# EAGLE design untitled4 (EAGLE 7.2.0)
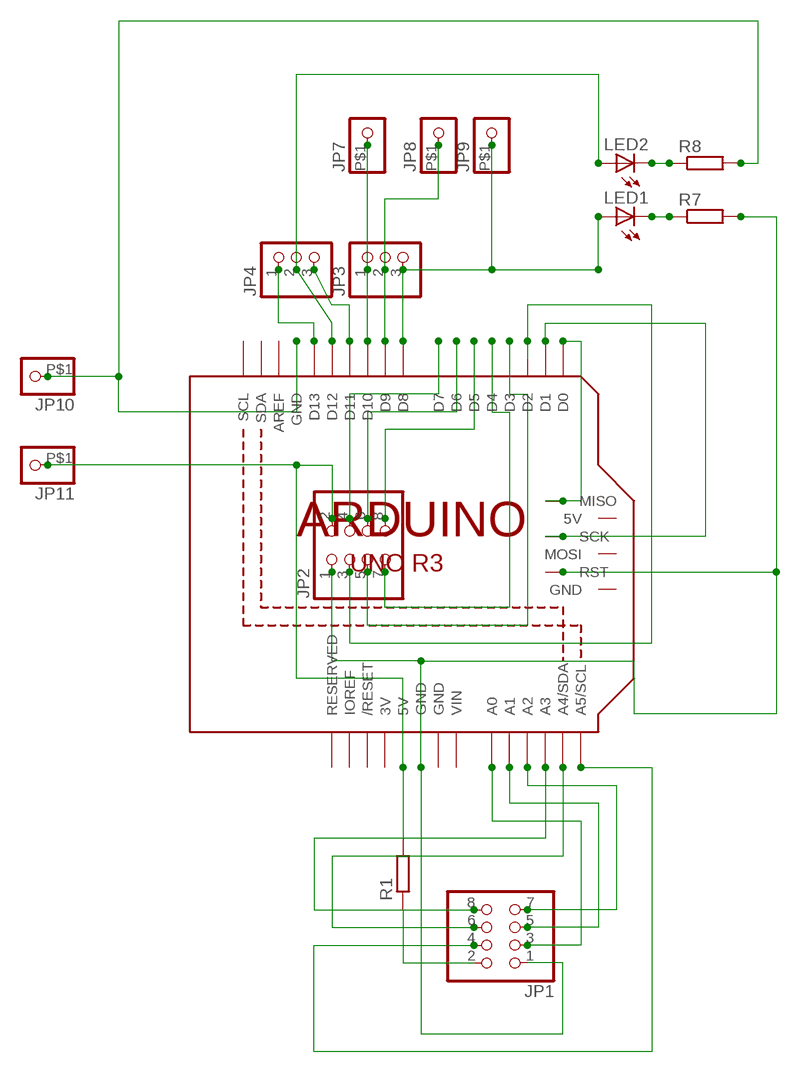
[diagram p0: schematic, sheet 1]

## Parts
JP1  PINHD-2X4  [2X04]
JP2  PINHD-2X4  [2X04]
JP3  PINHD-1X3  [1X03]
JP4  PINHD-1X3  [1X03]
JP7  PINHD-1X1-BIGPOGO  [1X1-BIGPOGO]
JP8  PINHD-1X1-BIGPOGO  [1X1-BIGPOGO]
JP9  PINHD-1X1-BIGPOGO  [1X1-BIGPOGO]
JP10  PINHD-1X1-BIGPOGO  [1X1-BIGPOGO]
JP11  PINHD-1X1-BIGPOGO  [1X1-BIGPOGO]
LED1  LED3MM  [LED3MM]
LED2  LED3MM  [LED3MM]
M1  ARDUINO_R3_ICSP_NODIM  [ARDUINOR3_ICSP_NODIM]
R1  R-EU_0207/10  [0207/10]
R7  R-EU_0207/10  [0207/10]
R8  R-EU_0207/10  [0207/10]

## Nets
N$2: JP2.2 JP11.P$1 M1.5V R1.2
N$3: M1.D0 M1.MISO
N$4: M1.D1 M1.SCK
N$6: JP1.2 R1.1
N$7: JP1.3 M1.A0
N$8: JP1.5 M1.A1
N$9: JP1.7 M1.A2
N$10: JP2.5 M1.D3
N$11: JP2.3 M1.D2
N$12: JP2.6 M1.D6
N$13: JP2.4 M1.D7
N$14: JP2.8 M1.D5
N$15: JP2.7 M1.D4
N$16: JP1.8 M1.A3
N$17: JP1.6 M1.A4(A4/SDA)
N$20: LED1.K(C) R7.1
N$21: JP4.3 M1.D11
N$23: JP10.P$1 M1.GND R8.2
N$26: JP1.4 M1.A5(A5/SCL)
N$29: LED2.K(C) R8.1
N$31: JP4.2 LED2.A M1.D12
N$32: JP4.1 M1.D13
N$33: JP3.2 JP8.P$1 M1.D9
N$34: JP3.1 JP7.P$1 M1.D10
N$35: JP3.3 JP9.P$1 LED1.A M1.D8
N$36: JP1.1 JP2.1 M1.GND@1(GND) R7.2
Unconnected: M1.5V_ICSP(5V) M1.AREF M1.GND@2(GND) M1.IOREF M1.MOSI M1.RESERVED M1.RESET(/RESET) M1.RESET_ICSP(RST) M1.SCL M1.SDA

## Power pins joined to a net without a drawn wire
3V: M1.3V
GND: M1.GND@3(GND)
VIN: M1.VIN

## Library data of the parts
JP1 JP2 = adafruit:PINHD-2X4: PIN HEADER
JP3 JP4 = adafruit:PINHD-1X3: PIN HEADER
JP7-JP11 = adafruit:PINHD-1X1: Pin header 1x1 for 0.1" spacing With round pins
LED1 LED2 = adafruit:LED: LED OSRAM: - CHIPLED LG R971, LG N971, LY N971, LG Q971, LY Q971, LO R971, LY R971 LH N974, LH R974 LS Q976, LO Q976, LY Q976 LO Q996 - Hyper CHIPLED LW Q18S LB Q993, LB Q99A, LB R99A - SideLED LS A670, LO A670, LY A670, LG A670, LP A670 LB A673, LV A673, LT A673, LW A673 LH A674 LY A675 LS A676, LA A676, LO A676, LY A676, LW A676 LS A679, LY A679, LG A679 - Hyper Micro SIDELED® LS Y876, LA Y876, LO Y876, LY Y876 LT Y87S - SmartLED LW L88C, LW L88S LB L89C, LB L89S, LG L890 LS L89K, LO L89K, LY L89K LS L896, LA L896, LO L896, LY L896 - TOPLED LS T670, LO T670, LY T670, LG T670, LP T670 LSG T670, LSP T670, LSY T670, LOP T670, LYG T670 LG T671, LOG T671, LSG T671 LB T673, LV T673, LT T673, LW T673 LH T674 LS T676, LA T676, LO T676, LY T676, LB T676, LH T676, LSB T676, LW T676 LB T67C, LV T67C, LT T67C, LS T67K, LO T67K, LY T67K, LW E67C LS E67B, LA E67B, LO E67B, LY E67B, LB E67C, LV E67C, LT E67C LW T67C LS T679, LY T679, LG T679 LS T770, LO T770, LY T770, LG T770, LP T770 LB T773, LV T773, LT T773, LW T773 LH T774 LS E675, LA E675, LY E675, LS T675 LS T776, LA T776, LO T776, LY T776, LB T776 LHGB T686 LT T68C, LB T68C - Hyper Mini TOPLED® LB M676 - Mini TOPLED Santana® LG M470 LS M47K, LO M47K, LY M47K Source: http://www.osram.convergy.de/
M1 = adafruit:ARDUINO_R3_ICSP
R1 R7 R8 = rcl:R-EU_: RESISTOR, European symbol

## Board
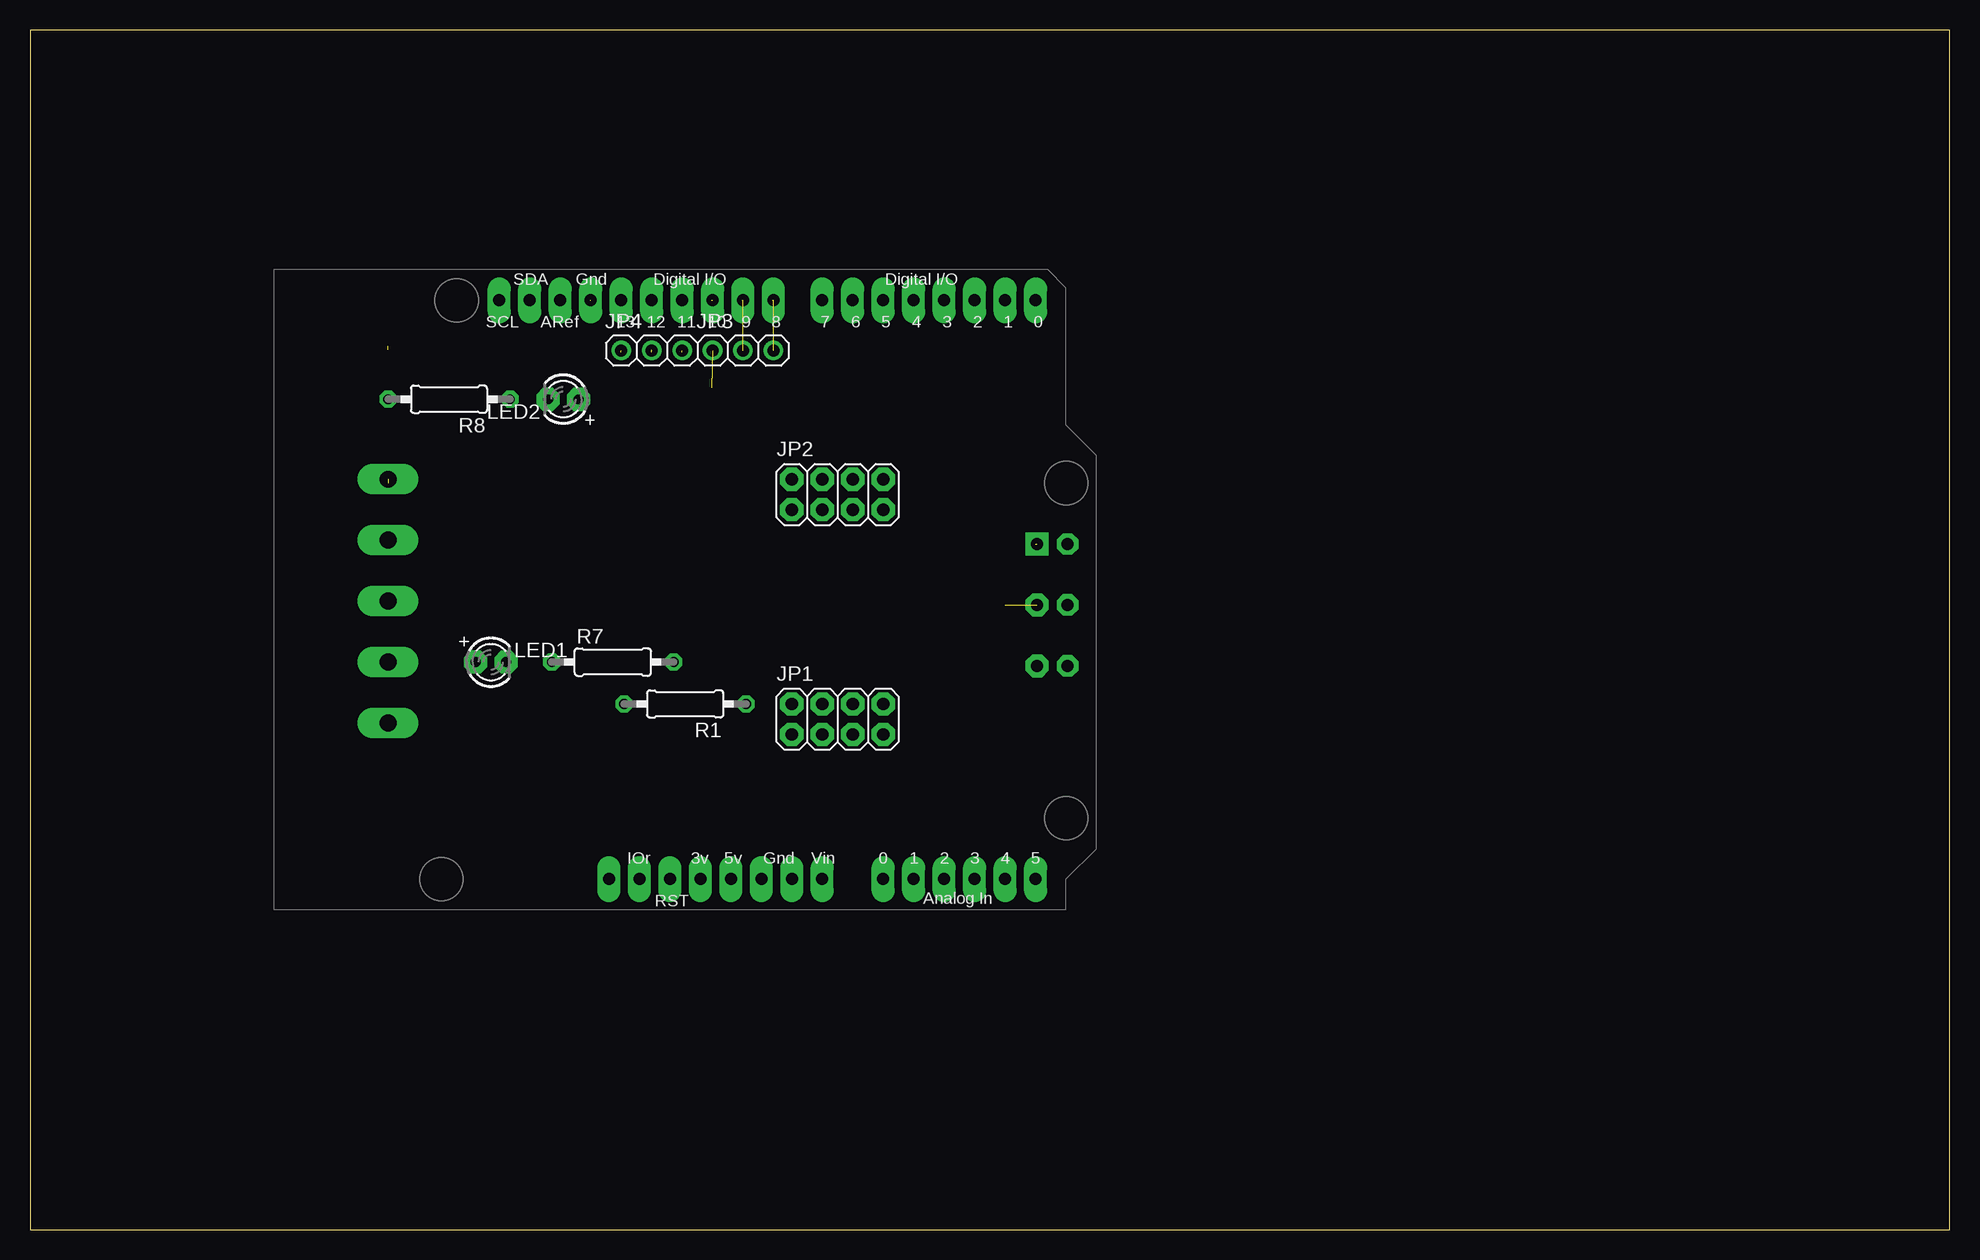
[diagram p1: board, top side]
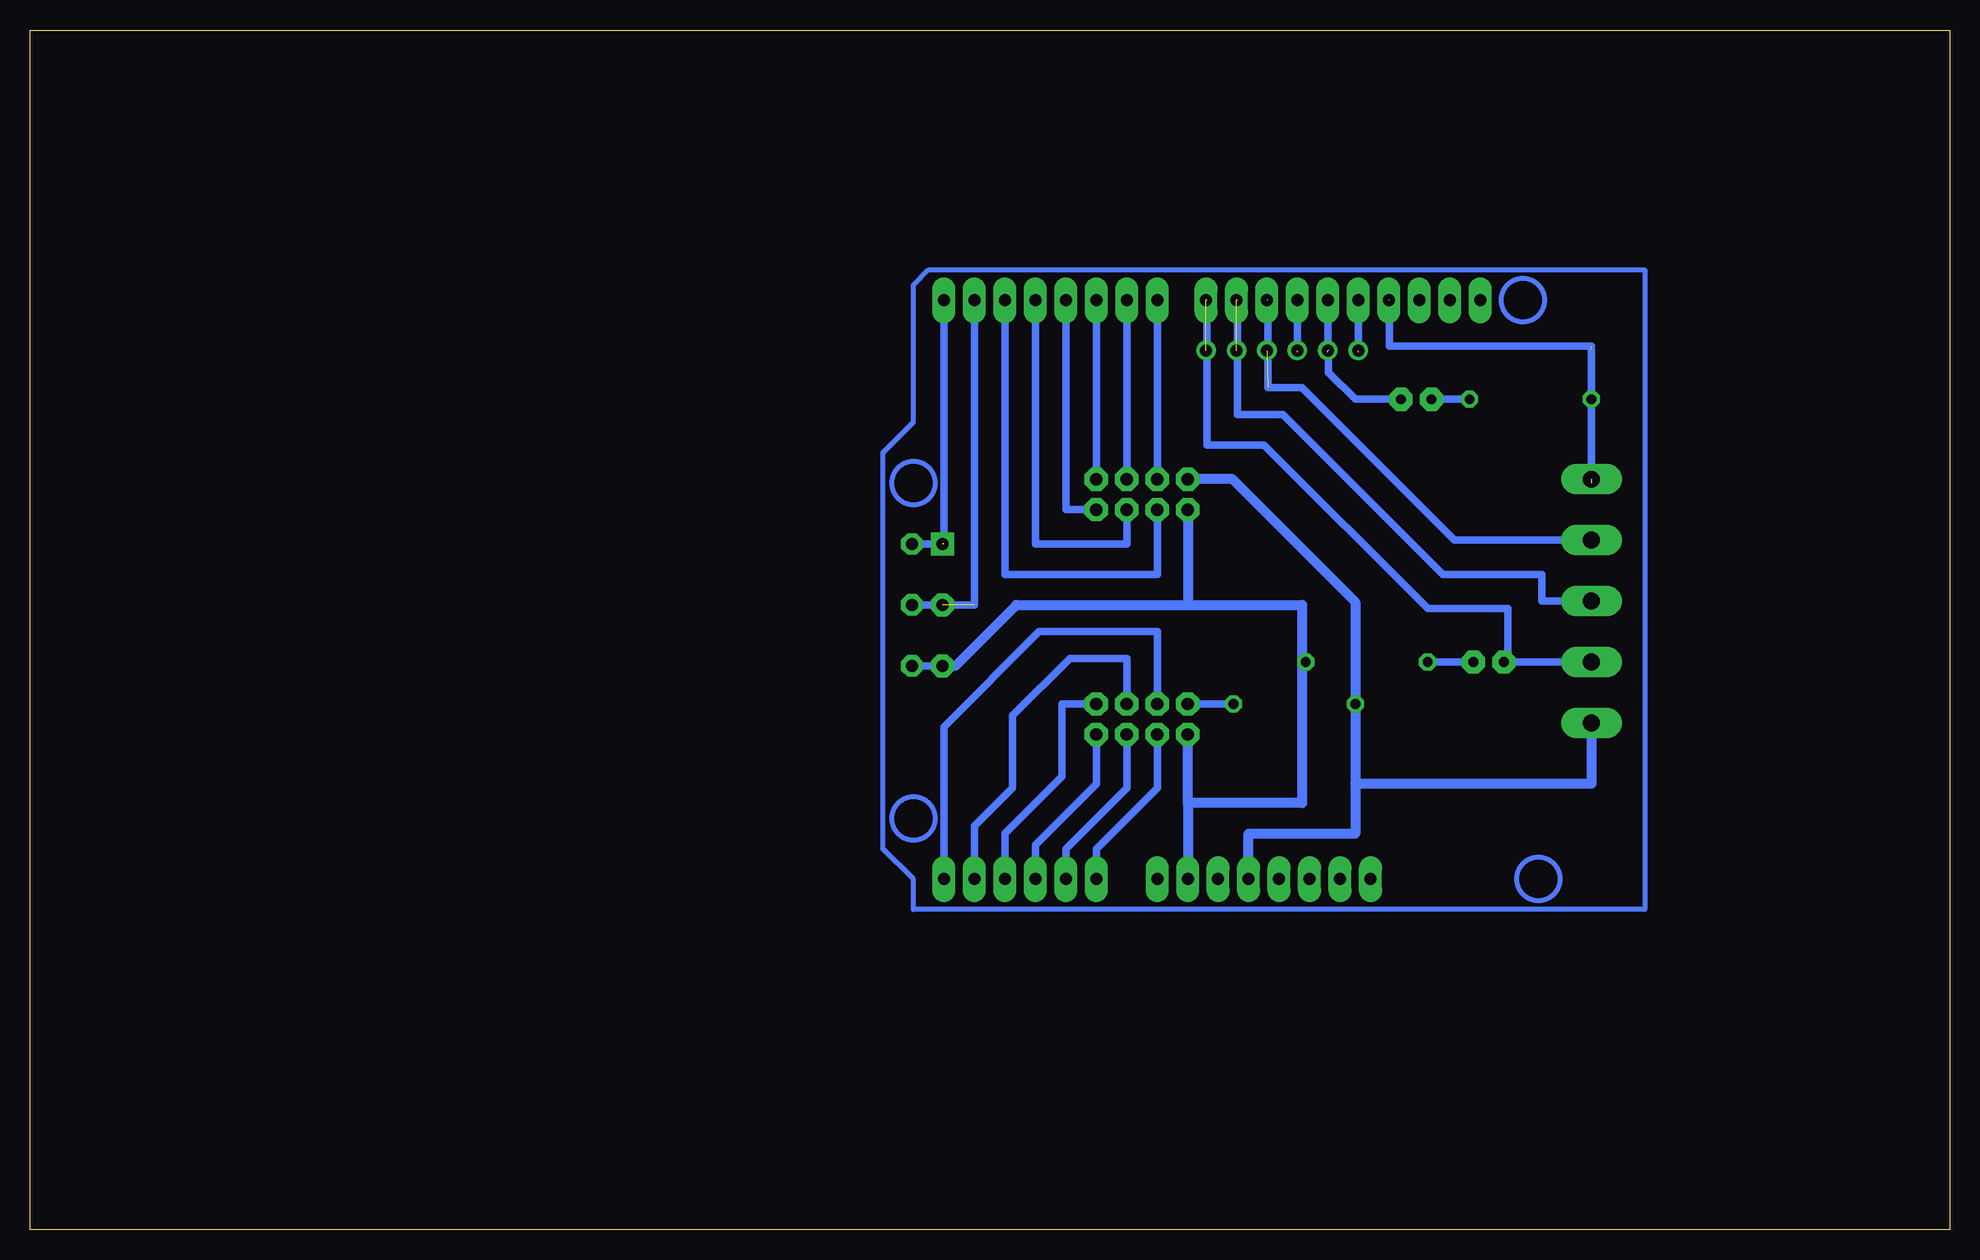
[diagram p2: board, bottom side, seen from below]

Size 160 x 100 mm. Coordinates in mm from the lower left corner, seen from the top.
Outline: 0,0 160,0 160,100 0,100 0,0
Copper layers (1*16): Top 0.035mm / dielectric 1.5mm / Bottom 0.035mm
Design rules "SparkFun *": minimum track width 8mil, minimum drill 18mil, track to track 15mil, track to pad 15mil, pad to pad 15mil, via to via 8mil, smd to smd 8mil, copper to edge 10mil, drill to drill 8mil, minimum pad ring 12mil, minimum via ring 10mil, stop-mask expansion 8mil, vias tented up to drill 25mil, thermal gap 16mil

### Footprints (pad centres in the part's own frame; a part is rotated, then mirrored left to right if it is on the bottom)
2X04 = drill 1.016 pad 1.93 octagon: 1 -3.81,-1.27; 2 -3.81,1.27; 3 -1.27,-1.27; 4 -1.27,1.27; 5 1.27,-1.27; 6 1.27,1.27; 7 3.81,-1.27; 8 3.81,1.27
1X03 = drill 1.016: 1 -2.54,0; 2 0,0; 3 2.54,0
1X1-BIGPOGO = drill 1.4 pad 2.54 long: P$1 0,0
LED3MM = drill 0.813 pad 1.93 octagon: A -1.27,0; K 1.27,0
ARDUINOR3_ICSP_NODIM = drill 1 pad 1.93 long: 3V 35.56,2.54; 5V 38.1,2.54; A0 50.8,2.54; A1 53.34,2.54; A2 55.88,2.54; A3 58.42,2.54; A4 60.96,2.54; A5 63.5,2.54; AREF 23.876,50.8; D0 63.5,50.8; D1 60.96,50.8; D2 58.42,50.8; D3 55.88,50.8; D4 53.34,50.8; D5 50.8,50.8; D6 48.26,50.8; D7 45.72,50.8; D8 41.656,50.8; D9 39.116,50.8; D10 36.576,50.8; D11 34.036,50.8; D12 31.496,50.8; D13 28.956,50.8; GND 26.416,50.8; GND@1 43.18,2.54; GND@2 40.64,2.54; IOREF 30.48,2.54; RESERVED 27.94,2.54; RESET 33.02,2.54; SCL 18.796,50.8; SDA 21.336,50.8; VIN 45.72,2.54 | drill 1 pad 1.778 octagon: 5V_ICSP 66.167,30.48; GND@3 66.167,20.32; MOSI 66.167,25.4 | drill 1 pad 1.93 square: MISO 63.627,30.48 | drill 1 pad 1.93 octagon: RESET_ICSP 63.627,20.32; SCK 63.627,25.4
0207/10 = drill 0.813 octagon: 1 -5.08,0; 2 5.08,0

### Placement (x,y rotation side)
JP1  67.31,42.55 0 top
JP2  67.31,61.28 0 top
JP3  59.44,73.28 0 top
JP4  51.82,73.28 0 top
JP7  29.84,57.47 0 top
JP8  29.84,52.39 0 top
JP9  29.84,47.31 0 top
JP10  29.84,62.55 0 top
JP11  29.84,42.23 0 top
LED1  38.42,47.31 0 top
LED2  44.45,69.22 180 top
M1  20.32,26.67 0 top
R1  54.61,43.81 180 top
R7  48.58,47.31 0 top
R8  34.92,69.22 180 top

### Tracks (layer width: path | path; a pad name or v marks a point on that pad's centre or on a via)
N$1
  Bottom 0.61: 84.14,46.99 86.36,46.99
N$2
  Bottom 0.61: R1.2 49.21,43.81
  Bottom 0.813: M1.5V 58.42,33.02 49.53,33.02 49.53,37.15 | JP2.2 59.78,62.55 49.53,52.3 R1.2 49.53,37.15 | JP11.P$1 29.84,37.15 49.53,37.15
N$3  (1 unrouted)
  Bottom 0.61: M1.D0 83.82,57.15
N$4  (1 unrouted)
  Bottom 0.61: M1.D1 81.28,52.07 86.68,52.07
N$5
  Bottom 0.61: 84.14,57.15 86.68,57.15
N$6
  Bottom 0.61: JP1.2 R1.1
N$7
  Bottom 0.61: M1.A0 71.12,31.75 66.04,36.83 JP1.3
N$8
  Bottom 0.61: M1.A1 73.66,31.75 68.58,36.83 JP1.5
N$9
  Bottom 0.61: M1.A2 76.2,32.07 71.12,37.15 JP1.7
N$10
  Bottom 0.61: JP2.5 68.58,57.15 76.2,57.15 M1.D3
N$11
  Bottom 0.61: JP2.3 66.04,54.61 78.74,54.61 M1.D2
N$12
  Bottom 0.61: M1.D6 JP2.6
N$13
  Bottom 0.61: M1.D7 JP2.4
N$14
  Bottom 0.61: M1.D5 JP2.8
N$15
  Bottom 0.61: M1.D4 73.66,60.01 JP2.7
N$16
  Bottom 0.61: M1.A3 78.74,33.02 73.98,37.78 73.98,43.81 JP1.8
N$17
  Bottom 0.61: M1.A4 81.28,33.66 78.11,36.83 78.11,42.84 73.32,47.62 68.58,47.62 JP1.6
N$20
  Bottom 0.61: R7.1 LED1.K
N$21  (1 unrouted)
  Bottom 0.61: M1.D11 54.36,73.15
N$22
  Bottom 0.406: 86.36,26.67 86.36,29.21 88.9,31.75 88.9,64.77 86.36,67.31 86.36,78.74 85.09,80.01 25.4,80.01 25.4,26.67 86.36,26.67
N$23  (3 unrouted)
  Bottom 0.61: 29.84,73.66 46.67,73.66 46.67,77.47 | 29.84,73.34 R8.2 29.84,62.23
N$26
  Bottom 0.61: M1.A5 83.82,41.91 75.88,49.85 66.04,49.85 JP1.4
N$29
  Bottom 0.61: R8.1 LED2.K
N$31  (2 unrouted)
  Bottom 0.61: M1.D12 51.82,73.15 | LED2.A 49.53,69.22 51.75,71.44 51.75,73.34
N$32  (1 unrouted)
  Bottom 0.61: M1.D13 49.28,73.15
N$33  (2 unrouted)
  Bottom 0.61: 59.37,77.47 59.37,67.94 55.56,67.94 42.23,54.61 33.97,54.61 33.97,52.39 JP8.P$1
N$34  (2 unrouted)
  Bottom 0.61: 56.83,77.47 56.83,70.17 53.98,70.17 41.27,57.47 JP7.P$1
N$35  (2 unrouted)
  Bottom 0.61: 61.91,77.47 61.91,65.41 57.15,65.41 43.5,51.75 36.83,51.75 36.83,47.31 | 36.83,47.31 JP9.P$1 | 36.83,47.31 LED1.A
N$36
  Bottom 0.61: 83.82,46.99 82.87,46.99 | R7.2 53.98,47.31
  Bottom 0.813: 82.87,46.99 77.79,52.07 63.5,52.07 | JP2.1 63.5,52.07 | 63.5,52.07 53.98,52.07 53.98,47.31 53.98,35.56 63.5,35.56 | 63.5,35.56 M1.GND@1 | 63.5,35.56 JP1.1
(copper drawn outside any net)
  shapes: Bottom circle x4